# EAGLE design LCD_board (EAGLE 6.6.0)
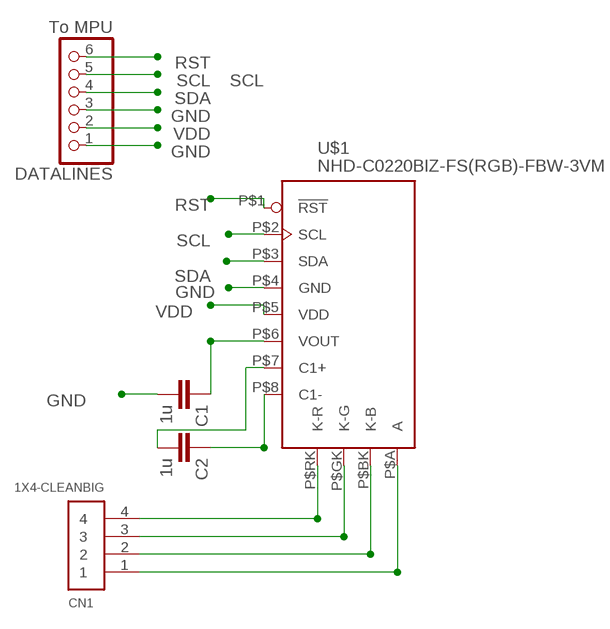
[diagram p0: schematic, sheet 1]

## Parts
C1  1u  C15/8  [C15B8]
C2  1u  C15/8  [C15B8]
CN1  1X4-CLEANBIG  [1X04-CLEANBIG]
DATALINES  To MPU  PINHD-1X6  [1X06]
U$1  NHD-C0220BIZ-FS(RGB)-FBW-3VM  [NHD-C0220BIZ-LCD]

## Nets
A: CN1.4 U$1.P$RK(K-R)
C1+: C2.2 U$1.P$7(C1+)
GK: CN1.2 U$1.P$BK(K-B)
GND: C1.2 DATALINES.1 DATALINES.3 U$1.P$4(GND)
N$1: C2.1 U$1.P$8(C1-)
N$2: CN1.3 U$1.P$GK(K-G)
N$3: C1.1 U$1.P$6(VOUT)
N$4: CN1.1 U$1.P$A(A)
RST: DATALINES.6 U$1.P$1(!RST)
SCL: DATALINES.5 U$1.P$2(SCL)
SDA: DATALINES.4 U$1.P$3(SDA)
VDD: DATALINES.2 U$1.P$5(VDD)

## Library data of the parts
C1 C2 = capacitor-wima:C: CAPACITOR naming: grid - package width
CN1 = adafruit:1X4: 4-pin connector
DATALINES = adafruit:PINHD-1X6: PIN HEADER
U$1 = LockBox:NHD-C0220BIZ-FS(RGB)-FBW-3VM: NHD-C0220Biz - Character Liquid Crystal DIsplay Module Source: http://www.newhavendisplay.com/specs/NHD-C0220BiZ-FSRGB-FBW-3VM.pdf; COG: 2x20; INTERFACE: I2C; VOLTS: 3.3V

## Board
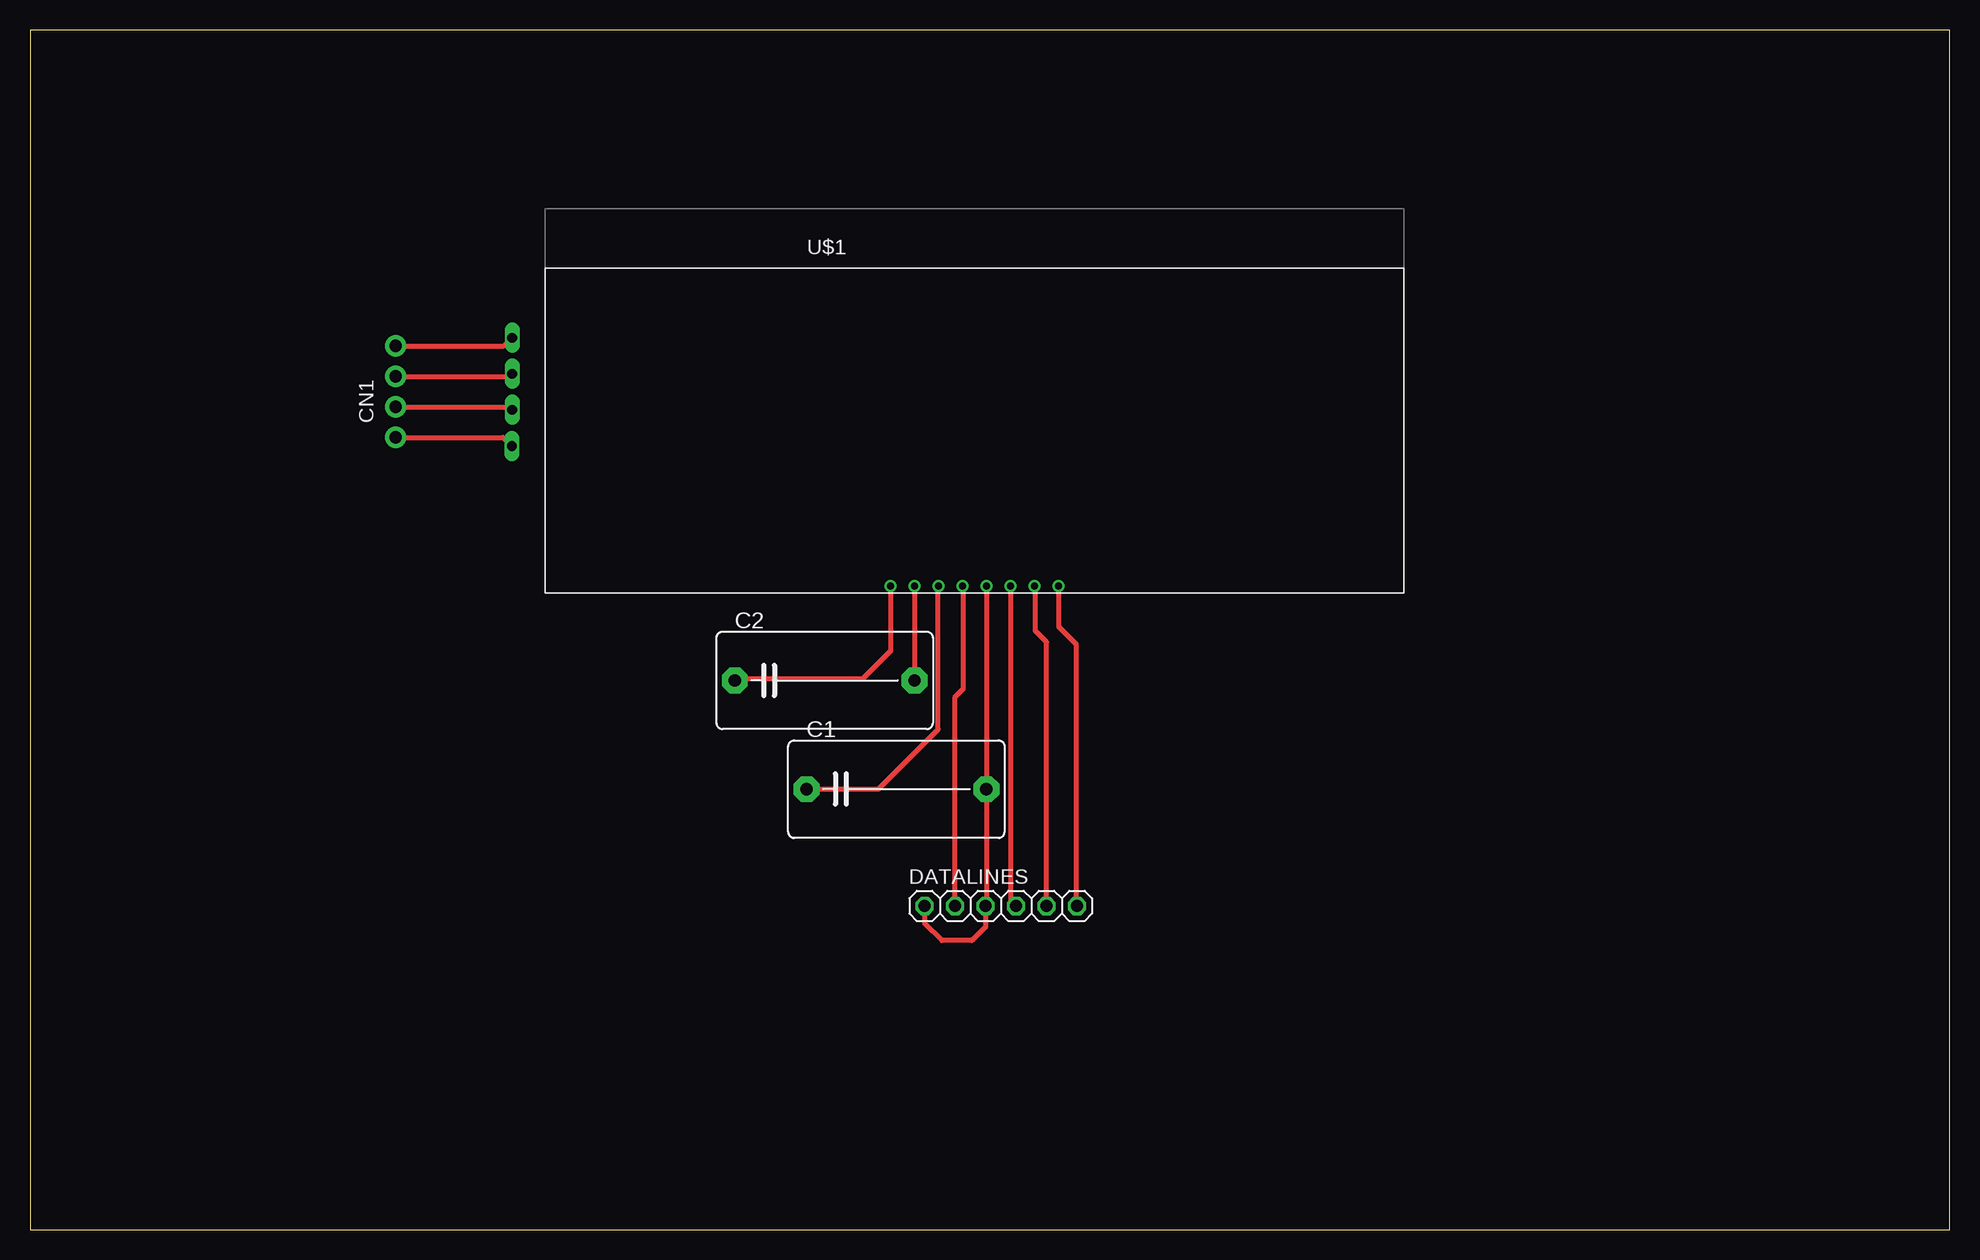
[diagram p1: board, top side]

Size 160 x 100 mm. Coordinates in mm from the lower left corner, seen from the top.
Outline: 0,0 160,0 160,100 0,100 0,0
Copper layers (1*16): Top 0.0178mm / dielectric 59mil / Bottom 0.0178mm
Design rules "epl-lpkf": minimum track width 8mil, minimum drill 0.35mm, track to track 8mil, track to pad 8mil, pad to pad 8mil, via to via 8mil, smd to smd 8mil, copper to edge 15mil, drill to drill 15mil, minimum pad ring 8mil, minimum via ring 8mil, stop-mask expansion 3mil, vias tented up to drill 0mil, thermal gap 10mil

### Footprints (pad centres in the part's own frame; a part is rotated, then mirrored left to right if it is on the bottom)
C15B8 = drill 1.016 pad 2.159 octagon: 1 -7.493,0; 2 7.493,0
1X04-CLEANBIG = drill 1.016 pad 1.778: 1 -3.81,0; 2 -1.27,0; 3 1.27,0; 4 3.81,0
1X06 = drill 1.016 octagon: 1 -6.35,0; 2 -3.81,0; 3 -1.27,0; 4 1.27,0; 5 3.81,0; 6 6.35,0
NHD-C0220BIZ-LCD = drill 0.6: P$1 7,-16.2; P$2 5,-16.2; P$3 3,-16.2; P$4 1,-16.2; P$5 -1,-16.2; P$6 -3,-16.2; P$7 -5,-16.2; P$8 -7,-16.2 | drill 0.8 pad 1.27 long: P$A -38.58,-4.54; P$BK -38.55,-1.5; P$GK -38.55,1.5; P$RK -38.55,4.5

### Placement (x,y rotation side)
C1  72.22,36.71 0 top
C2  66.24,45.78 0 top
CN1  30.48,69.85 90 top
DATALINES  80.92,26.97 0 top
U$1  78.74,69.85 0 top

### Tracks (layer width: path | path; a pad name or v marks a point on that pad's centre or on a via)
A
  Top 0.406: CN1.4 39.5,73.66 U$1.P$RK
C1+
  Top 0.406: U$1.P$7 C2.2
GK
  Top 0.406: CN1.2 39.96,68.58 U$1.P$BK
GND
  Top 0.406: U$1.P$4 79.74,36.74 C1.2 79.71,27.03 DATALINES.3 79.65,25.25 78.5,24.1 76,24.1 74.6,25.5 74.6,26.94 DATALINES.1
N$1
  Top 0.406: U$1.P$8 71.74,48.24 69.4,45.9 58.87,45.9 C2.1
N$2
  Top 0.406: CN1.3 39.96,71.12 U$1.P$GK
N$3
  Top 0.406: C1.1 70.71,36.71 75.7,41.7 75.7,53.61 U$1.P$6
N$4
  Top 0.406: CN1.1 39.43,66.04 U$1.P$A
RST
  Top 0.406: U$1.P$1 85.74,50.26 87.2,48.8 87.2,27.04 DATALINES.6
SCL
  Top 0.406: DATALINES.5 84.73,48.97 83.8,49.9 83.8,53.59 U$1.P$2
SDA
  Top 0.406: U$1.P$3 81.74,27.42 DATALINES.4
VDD
  Top 0.406: DATALINES.2 77.11,44.41 77.8,45.1 77.8,53.59 U$1.P$5